# Altium schematic sheet PAGE3 - SENSOR_SWITCHES.SchDoc: Koruza move driver
size A4; DrawnBy: Matej Gomboc; DocumentNumber: 3; Revision: 1.0; SheetNumber: 3; SheetTotal: 4
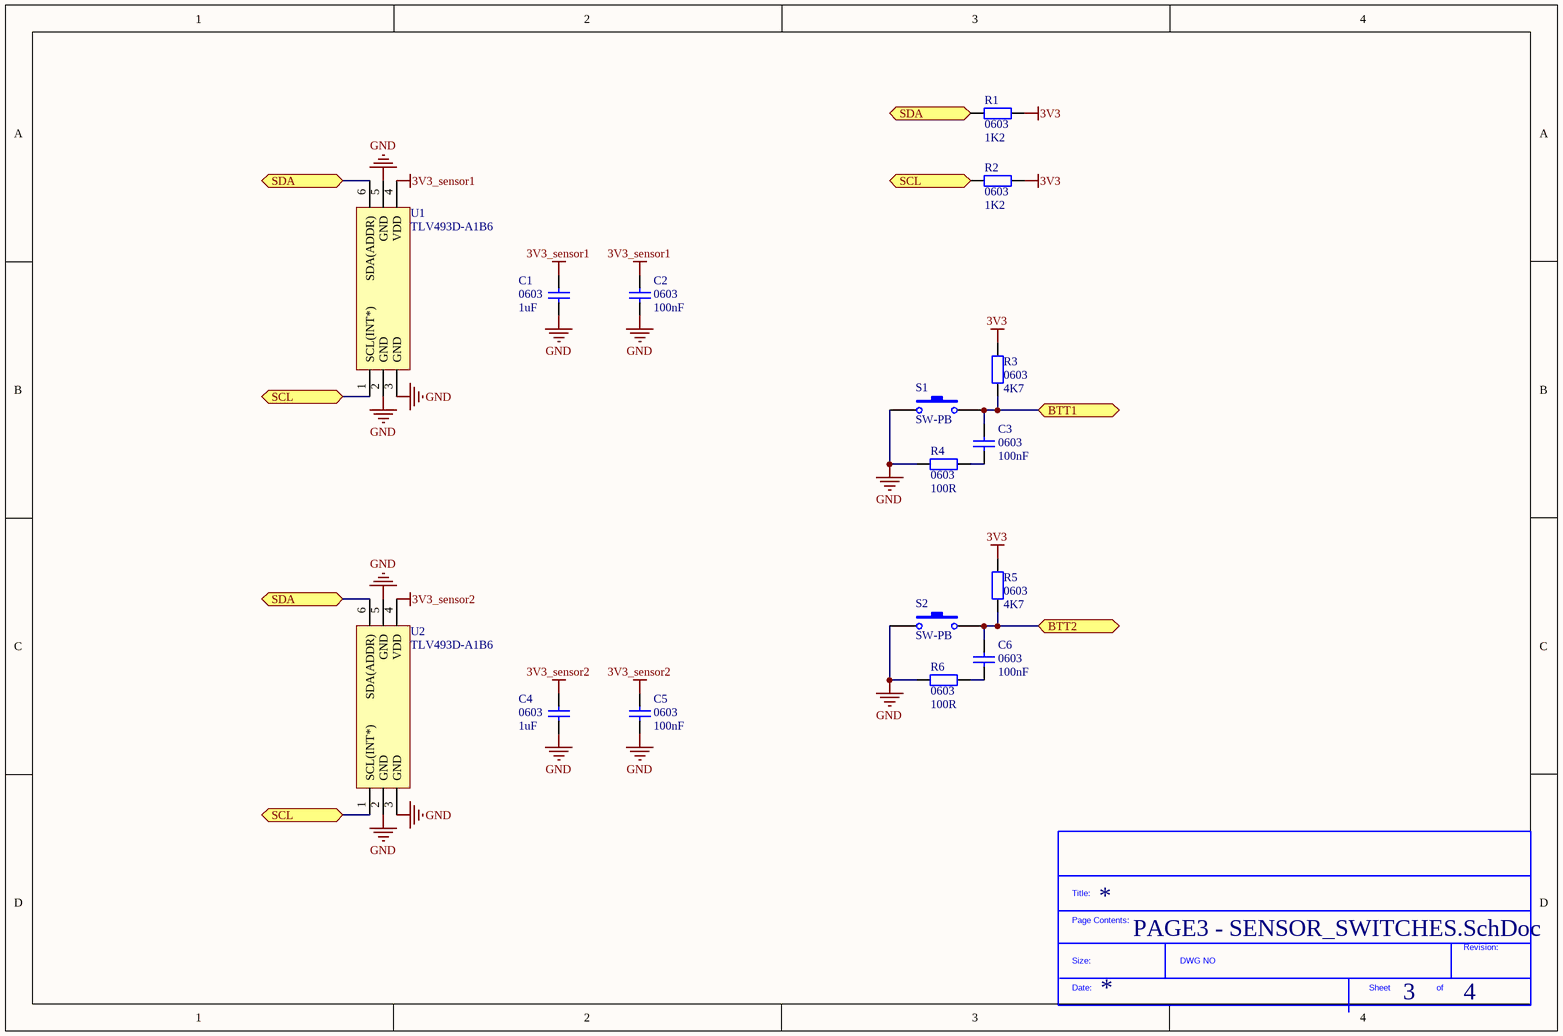
[diagram p0: PAGE3 - SENSOR_SWITCHES.SchDoc]

## Parts
*?  SDTitleBlock  (value not drawn)  (graphical)
C1  0603  value 1uF  [0603_HandSoldering]
C2  0603  value 100nF  [0603_HandSoldering]
C3  0603  value 100nF  [0603_HandSoldering]
C4  0603  value 1uF  [0603_HandSoldering]
C5  0603  value 100nF  [0603_HandSoldering]
C6  0603  value 100nF  [0603_HandSoldering]
R1  0603  value 1K2  [0603_HandSoldering]
R2  0603  value 1K2  [0603_HandSoldering]
R3  0603  value 4K7  [0603_HandSoldering]
R4  0603  value 100R  [0603_HandSoldering]
R5  0603  value 4K7  [0603_HandSoldering]
R6  0603  value 100R  [0603_HandSoldering]
S1  SW-PB  [KSS241G_switch]
S2  SW-PB  [KSS241G_switch]
U1  TLV493D-A1B6  [TLV493D_TSOP6]
U2  TLV493D-A1B6  [TLV493D_TSOP6]

## Ports
BTT1, BTT2, SCL, SDA

## Nets
3V3: R1.2 R2.2 R3.2 R5.2
3V3_sensor1: C1.2 C2.2 U1.4(VDD)
3V3_sensor2: C4.2 C5.2 U2.4(VDD)
GND: C1.1 C2.1 C4.1 C5.1 R4.1 R6.1 S1.1 S2.1 U1.2(GND) U1.3(GND) U1.5(GND) U2.2(GND) U2.3(GND) U2.5(GND)
BTT1: C3.2 R3.1 S1.2 ; port BTT1
BTT2: C6.2 R5.1 S2.2 ; port BTT2
SCL: R2.1 U1.1(SCL(INT*)) U2.1(SCL(INT*)) ; port SCL
SDA: R1.1 U1.6(SDA(ADDR)) U2.6(SDA(ADDR)) ; port SDA
NetC3_1: C3.1 R4.2
NetC6_1: C6.1 R6.2

## Notes on the sheet
- (in symbol SDTitleBlock) Title:; Page Contents:; Revision:; Size:; DWG NO; Date:; Sheet; of

## Library data of the parts
C1-C6 = capacitor_ceramic: Ceramic Capacitor
R1-R6 = resistor
S1 S2 = SW-PB: Limit Switch
U1 U2 = TLV493D-A1B6: 3D Magnetic Sensor